# EAGLE design 8hpPhase (EAGLE 9.3.1)
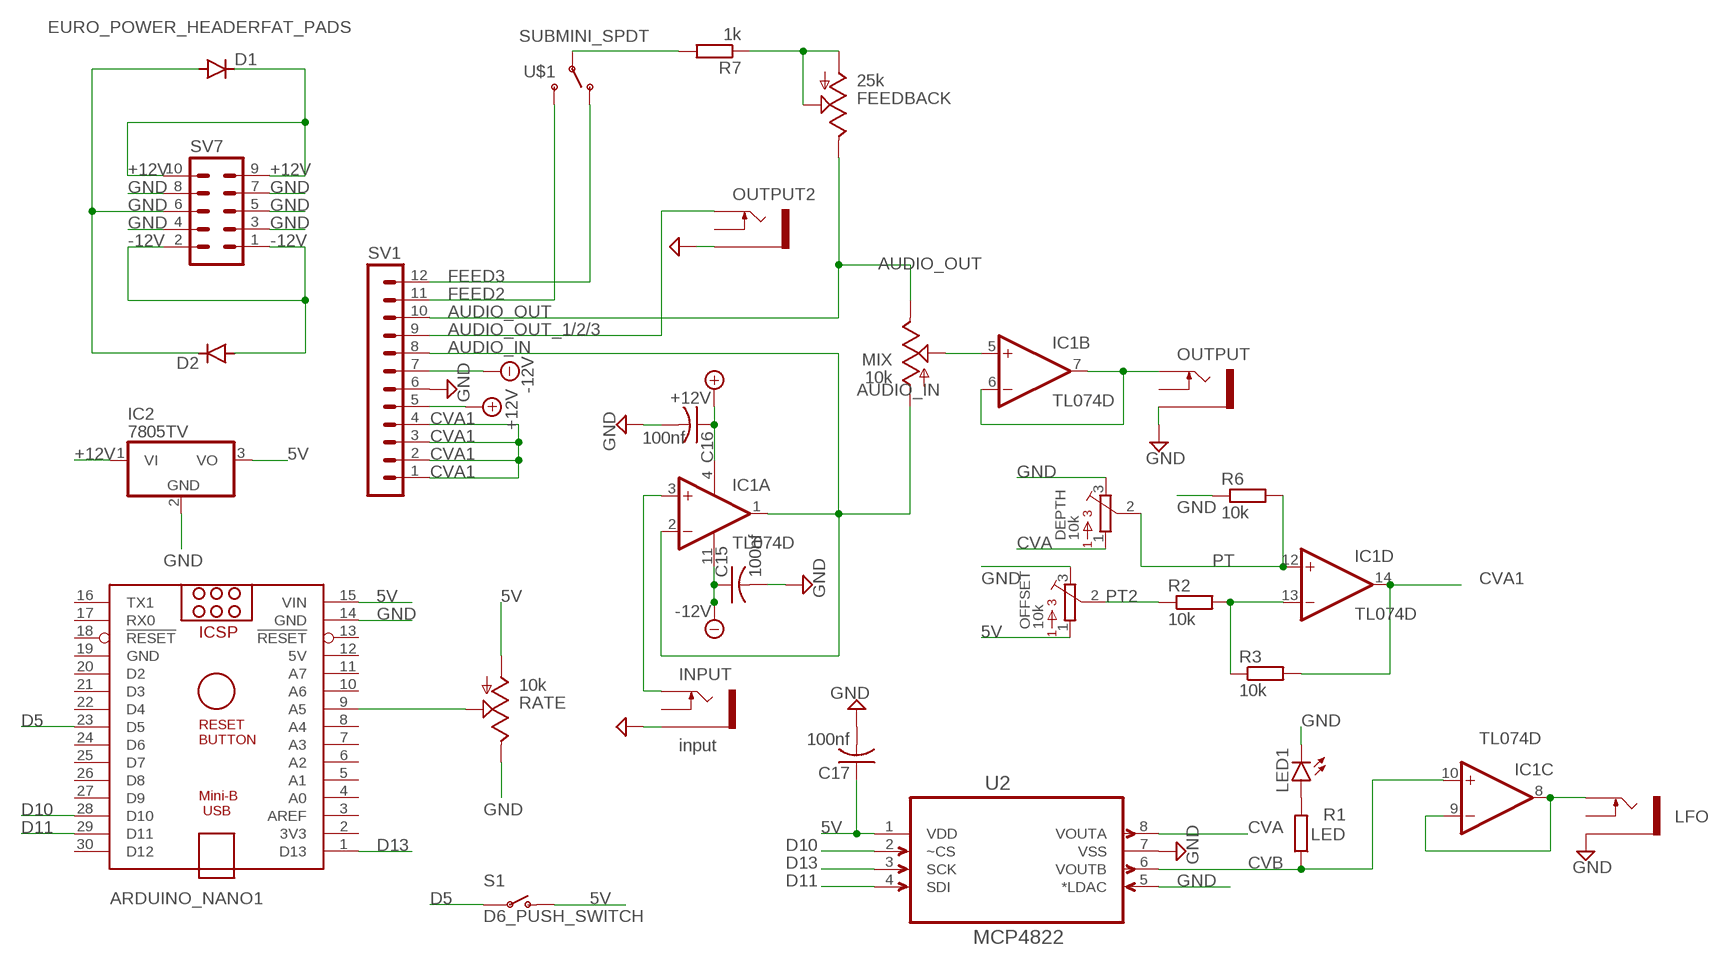
[diagram p0: schematic, sheet 1]

## Parts
ARDUINO_NANO1  ARDUINO_NANO  [ARDUINO_NANO]
C15  100nf  C-USC0805  [C0805]
C16  100nf  C-USC0805  [C0805]
C17  100nf  C-USC0805  [C0805]
D1  DIODE-SOD106A-R  [SOD106A-R]
D2  DIODE-SOD106A-R  [SOD106A-R]
DEPTH  10k  BOURNS_3362P_TRIMMERP  [BOURNS_3362P_TRIMMER]
FEEDBACK  25k  9MM_SNAP-IN_POT_  [9MM_SNAP-IN_POT]
IC1  TL074D  [SO14]
IC2  7805TV  [TO220V]
INPUT  input  THONKICONNNEW  [WQP-PJ301M-12_JACK]
LED1  LED3MM  [LED3MM]
LFO  output  THONKICONNNEW  [WQP-PJ301M-12_JACK]
MIX  10k  9MM_SNAP-IN_POT_  [9MM_SNAP-IN_POT]
OFFSET  10k  BOURNS_3362P_TRIMMERP  [BOURNS_3362P_TRIMMER]
OUTPUT  output  THONKICONNNEW  [WQP-PJ301M-12_JACK]
OUTPUT2  output  THONKICONNNEW  [WQP-PJ301M-12_JACK]
R1  LED  R-EU_M0805  [M0805]
R2  10k  R-EU_M0805  [M0805]
R3  10k  R-EU_M0805  [M0805]
R6  10k  R-EU_M0805  [M0805]
R7  1k  R-EU_M0805  [M0805]
RATE  10k  9MM_SNAP-IN_POT_  [9MM_SNAP-IN_POT]
S1  D6_PUSH_SWITCH  [D6_PUSH_SWITCH]
SV1  MA12-1  [MA12-1]
SV7  EURO_POWER_HEADERFAT_PADS  [EURO_PWR_HEADER_FAT]
U2  MCP4822  MCP4802-E/SN  [SOIC127P600X175-8N]
U$1  SUBMINI_SPDT  [SUBMINI_TOGGLE]

## Nets
5V: ARDUINO_NANO1.15(VIN) C17.1 IC2.3(VO) OFFSET.1 RATE.1(A) S1.P$1(O) S1.P$2(O) U2.1(VDD)
+12V: C16.1 D1.C IC1.4(P:V+) IC2.1(VI) SV1.5 SV7.9 SV7.10
-12V: C15.1 D2.A IC1.11(P:V-) SV1.7 SV7.1 SV7.2
AUDIO_IN: IC1.1(A:OUT) IC1.2(A:-IN) MIX.1(A) SV1.8
AUDIO_OUT: FEEDBACK.3(E) MIX.3(E) SV1.10
AUDIO_OUT_1/2/3: OUTPUT2.P$1_TIP(TIP) SV1.9
CVA: DEPTH.1 U2.8(VOUTA)
CVA1: IC1.14(D:OUT) R3.2 SV1.1 SV1.2 SV1.3 SV1.4
CVB: IC1.10(C:+IN) R1.1 U2.6(VOUTB)
D5: ARDUINO_NANO1.23(D5) S1.P$3(P) S1.P$4(P)
D10: ARDUINO_NANO1.28(D10) U2.2(~CS)
D11: ARDUINO_NANO1.29(D11) U2.4(SDI)
D13: ARDUINO_NANO1.1(D13) U2.3(SCK)
FEED2: SV1.11 U$1.3(S)
FEED3: SV1.12 U$1.1(O)
GND: ARDUINO_NANO1.14(GND) C15.2 C16.2 C17.2 D1.A D2.C DEPTH.3 IC2.2(GND) INPUT.P$3_SLEEVE(SLEEVE) LED1.K(C) LFO.P$3_SLEEVE(SLEEVE) OFFSET.3 OUTPUT2.P$3_SLEEVE(SLEEVE) OUTPUT.P$3_SLEEVE(SLEEVE) R6.1 RATE.3(E) SV1.6 SV7.3 SV7.4 SV7.5 SV7.6 SV7.7 SV7.8 U2.5(*LDAC) U2.7(VSS)
N$1: IC1.13(D:-IN) R2.2 R3.1
N$2: IC1.8(C:OUT) IC1.9(C:-IN) LFO.P$1_TIP(TIP)
N$3: LED1.A R1.2
N$4: ARDUINO_NANO1.9(A5) RATE.2(S)
N$5: IC1.5(B:+IN) MIX.2(S)
N$6: IC1.6(B:-IN) IC1.7(B:OUT) OUTPUT.P$1_TIP(TIP)
N$21: IC1.3(A:+IN) INPUT.P$1_TIP(TIP)
N$22: R7.2 U$1.COM(COMMON)
N$71: FEEDBACK.1(A) FEEDBACK.2(S) R7.1
PT: DEPTH.2 IC1.12(D:+IN) R6.2
PT2: OFFSET.2 R2.1
Unconnected: ARDUINO_NANO1.2(3V3) ARDUINO_NANO1.3(AREF) ARDUINO_NANO1.4(A0) ARDUINO_NANO1.5(A1) ARDUINO_NANO1.6(A2) ARDUINO_NANO1.7(A3) ARDUINO_NANO1.8(A4) ARDUINO_NANO1.10(A6) ARDUINO_NANO1.11(A7) ARDUINO_NANO1.13(!RESET) ARDUINO_NANO1.16(TX1) ARDUINO_NANO1.17(RX0) ARDUINO_NANO1.18(!RESET) ARDUINO_NANO1.20(D2) ARDUINO_NANO1.21(D3) ARDUINO_NANO1.22(D4) ARDUINO_NANO1.24(D6) ARDUINO_NANO1.25(D7) ARDUINO_NANO1.26(D8) ARDUINO_NANO1.27(D9) ARDUINO_NANO1.30(D12) INPUT.P$2_SWITCH(SWITCH) LFO.P$2_SWITCH(SWITCH) OUTPUT2.P$2_SWITCH(SWITCH) OUTPUT.P$2_SWITCH(SWITCH)

## Power pins joined to a net without a drawn wire
5V: ARDUINO_NANO1.12(5V)
GND: ARDUINO_NANO1.19(GND)

## Library data of the parts
ARDUINO_NANO1 = ArduinoNanoV30:ARDUINO_NANO: Arduino Nano V3.0 Overview: The Arduino Nano is a small, complete, and breadboard-friendly board based on the ATmega328 (Arduino Nano 3.x) or ATmega168 (Arduino Nano 2.x). It has more or less the same functionality of the Arduino Duemilanove, but in a different package. It lacks only a DC power jack, and works with a Mini-B USB cable instead of a standard one. The Nano was designed and is being produced by Gravitech. Specifications: Microcontroller Atmel ATmega168 or ATmega328 Operating Voltage (logic level) 5 V Input Voltage (recommended) 7-12 V Input Voltage (limits) 6-20 V Digital I/O Pins 14 (of which 6 provide PWM output) Analog Input Pins 8 DC Current per I/O Pin 40 mA Flash Memory 16 KB (ATmega168) or 32 KB (ATmega328) of which 2 KB used by bootloader SRAM 1 KB (ATmega168) or 2 KB (ATmega328) EEPROM 512 bytes (ATmega168) or 1 KB (ATmega328) Clock Speed 16 MHz Dimensions 0.73" x 1.70" Length 45 mm Width 18 mm Weigth 5 g Power: The Arduino Nano can be powered via the Mini-B USB connection, 6-20V unregulated external power supply (pin 30), or 5V regulated external power supply (pin 27). The power source is automatically selected to the highest voltage source. Memory: The ATmega168 has 16 KB of flash memory for storing code (of which 2 KB is used for the bootloader); the ATmega328 has 32 KB, (also with 2 KB used for the bootloader). The ATmega168 has 1 KB of SRAM and 512 bytes of EEPROM (which can be read and written with the EEPROM library); the ATmega328 has 2 KB of SRAM and 1 KB of EEPROM. Input and Output: Each of the 14 digital pins on the Nano can be used as an input or output, using pinMode(), digitalWrite(), and digitalRead() functions. They operate at 5 volts. Each pin can provide or receive a maximum of 40 mA and has an internal pull-up resistor (disconnected by default) of 20-50 kOhms. In addition, some pins have specialized functions. Visit Arduino - ArduinoBoardNano <https://www.arduino.cc/en/Main/ArduinoBoardNano>
C15-C17 = rcl:C-US: CAPACITOR, American symbol; SPICEPREFIX: C
D1 D2 = diode:DIODE-: DIODE
DEPTH OFFSET = MusicThingModular:BOURNS_3362P_TRIMMER: 3362 Series 1/4" Square Trimmer
FEEDBACK MIX RATE = MusicThingModular:9MM_SNAP-IN_POT: 9mm vertical snap-in pot, Alpha / Panasonic style
IC1 = linear:TL074: OP AMP
IC2 = linear:78*: Positive VOLTAGE REGULATOR Source: http://cache.national.com/ds/LM/LM78L05.pdf http://www.fairchildsemi.com/ds/LM/LM7805.pdf
INPUT LFO OUTPUT OUTPUT2 = MusicThingModular:THONKICONN: 3.5mm socket for Eurorack modular synths
LED1 = led:LED: LED OSRAM: - CHIPLED LG R971, LG N971, LY N971, LG Q971, LY Q971, LO R971, LY R971 LH N974, LH R974 LS Q976, LO Q976, LY Q976 LO Q996 - Hyper CHIPLED LW Q18S LB Q993, LB Q99A, LB R99A - SideLED LS A670, LO A670, LY A670, LG A670, LP A670 LB A673, LV A673, LT A673, LW A673 LH A674 LY A675 LS A676, LA A676, LO A676, LY A676, LW A676 LS A679, LY A679, LG A679 - Hyper Micro SIDELED® LS Y876, LA Y876, LO Y876, LY Y876 LT Y87S - SmartLED LW L88C, LW L88S LB L89C, LB L89S, LG L890 LS L89K, LO L89K, LY L89K LS L896, LA L896, LO L896, LY L896 - TOPLED LS T670, LO T670, LY T670, LG T670, LP T670 LSG T670, LSP T670, LSY T670, LOP T670, LYG T670 LG T671, LOG T671, LSG T671 LB T673, LV T673, LT T673, LW T673 LH T674 LS T676, LA T676, LO T676, LY T676, LB T676, LH T676, LSB T676, LW T676 LB T67C, LV T67C, LT T67C, LS T67K, LO T67K, LY T67K, LW E67C LS E67B, LA E67B, LO E67B, LY E67B, LB E67C, LV E67C, LT E67C LW T67C LS T679, LY T679, LG T679 LS T770, LO T770, LY T770, LG T770, LP T770 LB T773, LV T773, LT T773, LW T773 LH T774 LS E675, LA E675, LY E675, LS T675 LS T776, LA T776, LO T776, LY T776, LB T776 LHGB T686 LT T68C, LB T68C - Hyper Mini TOPLED® LB M676 - Mini TOPLED Santana® LG M470 LS M47K, LO M47K, LY M47K Source: http://www.osram.convergy.de LUXEON: - LUMILED® LXK2-PW12-R00, LXK2-PW12-S00, LXK2-PW14-U00, LXK2-PW14-V00 LXK2-PM12-R00, LXK2-PM12-S00, LXK2-PM14-U00 LXK2-PE12-Q00, LXK2-PE12-R00, LXK2-PE12-S00, LXK2-PE14-T00, LXK2-PE14-U00 LXK2-PB12-K00, LXK2-PB12-L00, LXK2-PB12-M00, LXK2-PB14-N00, LXK2-PB14-P00, LXK2-PB14-Q00 LXK2-PR12-L00, LXK2-PR12-M00, LXK2-PR14-Q00, LXK2-PR14-R00 LXK2-PD12-Q00, LXK2-PD12-R00, LXK2-PD12-S00 LXK2-PH12-R00, LXK2-PH12-S00 LXK2-PL12-P00, LXK2-PL12-Q00, LXK2-PL12-R00 Source: www.luxeon.com KINGBRIGHT: KA-3528ASYC Source: www.kingbright.com
R1-R3 R6 R7 = rcl:R-EU_: RESISTOR, European symbol; SPICEPREFIX: R
S1 = MusicThingModular:D6_PUSH_SWITCH: Push switch
SV1 = con-lstb:MA12-1: PIN HEADER; OC_FARNELL: unknown; OC_NEWARK: unknown
SV7 = MusicThingModular:EURO_POWER_HEADER: Power Header 10 pin power header for Eurorack Power Supplies Variants with fatter pads for easier soldering, and the LOCK variant which has 5mil offset pins to hold the component in place before soldering
U2 = MCP4802-E_SN:MCP4802-E/SN: DAC 8BIT DUAL SPI/VREF; DESCRIPTION: MCP4801 Series 2 Ch 8-bit SPI Interface Digital-to-Analog Converter - SOIC-8; DIGI-KEY_PART_NUMBER: MCP4802-E/SN-ND; DIGI-KEY_PURCHASE_URL: https://www.digikey.com/product-detail/en/microchip-technology/MCP4802-E-SN/MCP4802-E-SN-ND/2332808?utm_source=snapeda&utm_medium=aggregator&utm_campaign=symbol; MF: Microchip; MP: MCP4802-E/SN; PACKAGE: SOIC-8 Microchip
U$1 = MusicThingModular:SUBMINI_SPDT

## Net classes
0 default: width 0.635 mm, drill 0.254 mm, clearance 0.254 mm
1 thicker: width 1.905 mm, drill 0.254 mm, clearance 0.635 mm
2 biggi: width 3.81 mm, drill 0.635 mm, clearance 0.635 mm

## Board
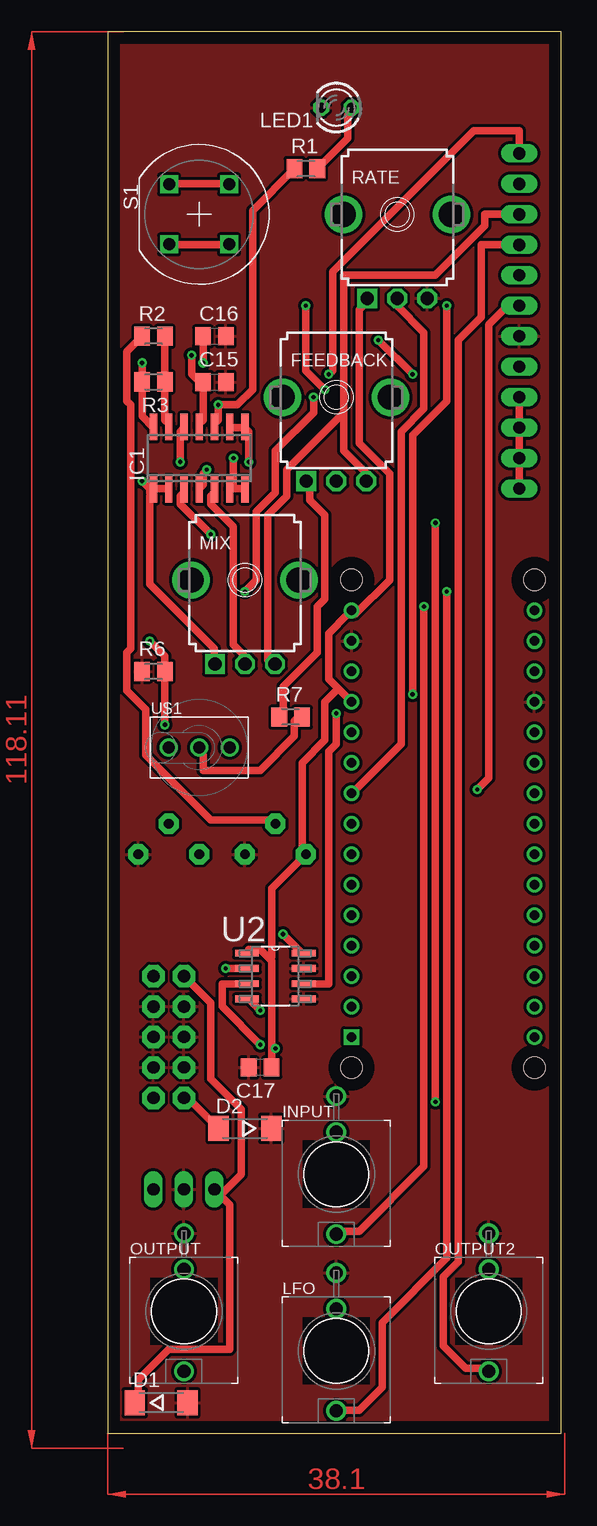
[diagram p1: board, top side]
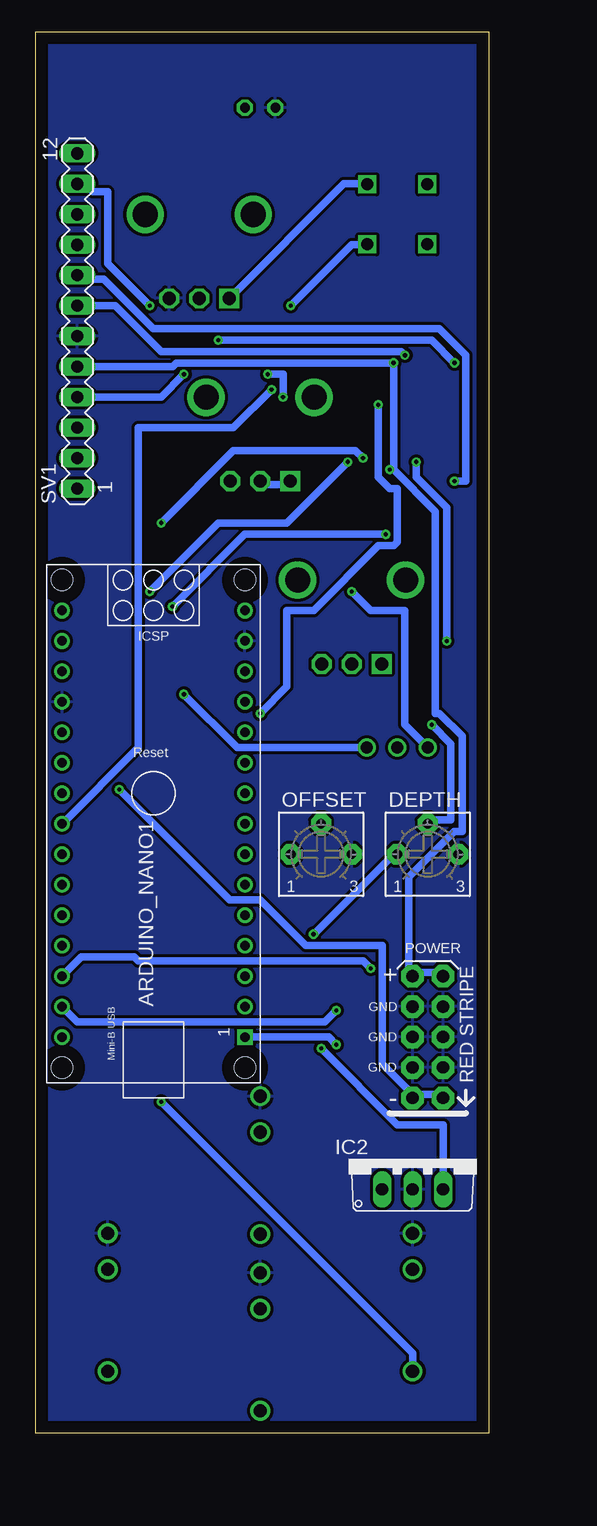
[diagram p2: board, bottom side, seen from below]

Size 37.77 x 116.83 mm. Coordinates in mm from the lower left corner, seen from the top.
Outline: 0,0 37.77,0 37.77,116.83 0,116.83 0,0
Copper layers (1*16): Top 0.035mm / dielectric 1.5mm / Bottom 0.035mm
Design rules "default": minimum track width 6mil, minimum drill 0.35mm, track to track 6mil, track to pad 6mil, pad to pad 6mil, via to via 6mil, smd to smd 6mil, copper to edge 40mil, drill to drill 6mil, minimum pad ring 10mil, minimum via ring 8mil, stop-mask expansion 4mil, vias tented up to drill 0mil, thermal gap 10mil

### Footprints (pad centres in the part's own frame; a part is rotated, then mirrored left to right if it is on the bottom)
ARDUINO_NANO = drill 0.8 square: 1 -20.32,-7.62 | drill 0.8: 2 -17.78,-7.62; 3 -15.24,-7.62; 4 -12.7,-7.62; 5 -10.16,-7.62; 6 -7.62,-7.62; 7 -5.08,-7.62; 8 -2.54,-7.62; 9 0,-7.62; 10 2.54,-7.62; 11 5.08,-7.62; 12 7.62,-7.62; 13 10.16,-7.62; 14 12.7,-7.62; 15 15.24,-7.62; 16 15.24,7.62; 17 12.7,7.62; 18 10.16,7.62; 19 7.62,7.62; 20 5.08,7.62; 21 2.54,7.62; 22 0,7.62; 23 -2.54,7.62; 24 -5.08,7.62; 25 -7.62,7.62; 26 -10.16,7.62; 27 -12.7,7.62; 28 -15.24,7.62; 29 -17.78,7.62; 30 -20.32,7.62 | hole 1.778: -22.86,-7.62; -22.86,7.62; 17.78,7.62; 17.78,-7.62
C0805 = smd 1.3 x 1.5: 1 -0.95,0; 2 0.95,0
SOD106A-R = smd 1.7 x 2.1: A 2.2,0; C -2.2,0
BOURNS_3362P_TRIMMER = drill 0.813 pad 1.676 octagon: 1 -2.54,0; 2 0,2.54; 3 2.54,0
9MM_SNAP-IN_POT = drill 1.1 square: 1 -2.5,-7 | drill 1.1 octagon: 2 0,-7; 3 2.5,-7 | drill 2.1 pad 2.794: CHASSIS1 -4.5,0; CHASSIS2 4.5,0
SO14 = smd 0.6 x 2.2: 1 -3.81,-2.6; 2 -2.54,-2.6; 3 -1.27,-2.6; 4 0,-2.6; 5 1.27,-2.6; 6 2.54,-2.6; 7 3.81,-2.6; 8 3.81,2.6; 9 2.54,2.6; 10 1.27,2.6; 11 0,2.6; 12 -1.27,2.6; 13 -2.54,2.6; 14 -3.81,2.6
TO220V = drill 1.016 long: 1 -2.54,-2.54; 2 0,-2.54; 3 2.54,-2.54
WQP-PJ301M-12_JACK = drill 1.1: P$1_TIP 0,5; P$2_SWITCH 0,-3.5; P$3_SLEEVE 0,-6.5
LED3MM = drill 0.813 octagon: A -1.27,0; K 1.27,0
M0805 = smd 1.3 x 1.6: 1 -0.95,0; 2 0.95,0
D6_PUSH_SWITCH = drill 1 square: P$1 -2.5,2.5; P$2 2.5,2.5; P$3 2.5,-2.5; P$4 -2.5,-2.5
MA12-1 = drill 1.016 long: 1 -13.97,0; 2 -11.43,0; 3 -8.89,0; 4 -6.35,0; 5 -3.81,0; 6 -1.27,0; 7 1.27,0; 8 3.81,0; 9 6.35,0; 10 8.89,0; 11 11.43,0; 12 13.97,0
EURO_PWR_HEADER_FAT = drill 1.016 pad 1.88 octagon: 1 -5.08,-1.27; 2 -5.08,1.27; 3 -2.54,-1.27; 4 -2.54,1.27; 5 0,-1.27; 6 0,1.27; 7 2.54,-1.27; 8 2.54,1.27; 9 5.08,-1.27; 10 5.08,1.27
SOIC127P600X175-8N = smd 1.981 x 0.559: 1 -2.362,1.905; 2 -2.362,0.635; 3 -2.362,-0.635; 4 -2.362,-1.905; 5 2.362,-1.905; 6 2.362,-0.635; 7 2.362,0.635; 8 2.362,1.905
SUBMINI_TOGGLE = drill 1 pad 1.422: 1 -2.54,0; 3 2.54,0; COM 0,0

### Placement (x,y rotation side)
ARDUINO_NANO1  27.94,53.34 90 bottom
C15  8.89,87.63 0 top
C16  8.89,91.44 0 top
C17  12.7,30.48 180 top
D1  4.45,2.54 0 top
D2  11.43,25.4 180 top
DEPTH  5.08,48.26 0 bottom
FEEDBACK  19.05,86.36 0 top
IC1  7.62,81.28 0 top
IC2  6.35,22.86 0 bottom
INPUT  19.05,21.59 180 top
LED1  19.05,110.49 180 top
LFO  19.05,6.86 180 top
MIX  11.43,71.12 0 top
OFFSET  13.97,48.26 0 bottom
OUTPUT  6.35,10.16 180 top
OUTPUT2  31.75,10.16 180 top
R1  16.51,105.41 0 top
R2  3.81,91.44 0 top
R3  3.81,87.63 180 top
R6  3.81,63.5 0 top
R7  15.24,59.69 0 top
RATE  24.13,101.6 0 top
S1  7.62,101.6 0 top
SV1  34.29,92.71 90 bottom
SV7  5.08,33.02 90 bottom
U2  13.97,38.1 0 top
U$1  7.62,57.15 0 top

### Tracks (layer width: path | path; a pad name or v marks a point on that pad's centre or on a via)
5V  (via drill 0.35)
  Top 0.635: S1.P$1 5.4,104.14 9.84,104.14 S1.P$2 | 19.21,62.07 18.41,62.87 18.41,66.67 20,68.26 20.32,68.26 | 19.21,62.07 ARDUINO_NANO1.12 | 13.65,32.07 13.65,39.37 13.49,39.53 | 13.65,32.07 C17.1 | 13.49,39.53 12.7,40.32 11.75,40.32 11.75,40.01 U2.1 | 13.65,32.07 v13.97,32.07 | 13.49,39.53 13.65,39.69 13.65,45.4 OFFSET.1 16.19,48.26 16.19,55.88 18.1,57.78 18.1,60.96 19.21,62.07 | 20.32,68.26 20.64,68.26 23.5,71.12 23.5,80.01 20.95,82.55 20.95,93.66 21.59,94.3 RATE.1 | 20.32,68.26 ARDUINO_NANO1.15
  Bottom 0.635: RATE.1 21.59,94.61 12.06,104.14 10.16,104.14 S1.P$2 | IC2.3 3.81,25.72 7.62,25.72 v13.97,32.07
+12V  (via drill 0.35)
  Top 0.635: v7.94,89.22 C16.1 | v8.26,80.33 7.94,80.01 7.94,79.06 7.62,78.74 IC1.4 | D1.C 2.54,2.54 2.54,4.45 5.08,6.99 10.16,6.99 10.16,19.05 IC2.1 9.53,20 11.11,21.59 11.11,26.99 8.57,29.53 8.57,35.88 SV7.10
  Bottom 0.635: 7.94,80.33 v7.94,89.22 26.04,89.22 26.35,88.9 SV1.5 | SV7.9 4.13,38.42 6.03,38.42 SV7.10 6.35,38.42 6.67,38.42 6.67,46.35 2.86,50.16 2.22,50.16 2.22,58.1 4.13,60.01 4.45,60.01 4.45,76.83 7.94,80.33 | 7.94,80.33 v8.26,80.33
-12V  (via drill 0.35)
  Top 0.635: SV7.2 6.67,27.94 9.21,25.4 D2.A | 7.94,87.31 7.94,84.45 7.62,84.14 IC1.11 | 7.94,87.31 C15.1 7.94,87.31 | v6.99,89.85 6.99,88.27 7.94,87.31 | v30.8,53.66 31.75,54.61 31.75,92.39 33.34,93.98 SV1.7
  Bottom 0.635: SV7.1 4.13,28.26 6.03,28.26 SV7.2 6.35,28.26 8.89,30.8 8.89,40.64 15.24,40.64 19.05,44.45 21.59,44.45 v30.8,53.66 | SV1.7 31.11,93.98 27.3,90.17 7.3,90.17 v6.99,89.85
AUDIO_IN  (via drill 0.35)
  Top 0.635: IC1.2 5.08,78.74 3.81,78.74 IC1.1 3.81,78.42 3.65,78.26 | 3.65,78.26 3.49,78.11 3.49,70.8 8.89,65.41 8.89,64.14 MIX.1 | v2.86,79.38 3.49,78.74 3.49,78.42 3.65,78.26
  Bottom 0.635: SV1.8 33.97,96.2 32.07,96.2 27.94,92.08 4.13,92.08 1.91,89.85 1.91,79.38 v2.86,79.38
AUDIO_OUT
  Top 0.635: SV1.10 31.43,101.6 31.43,100.65 27.3,96.52 19.68,96.52 19.68,85.09 | 19.68,85.09 19.68,81.92 21.59,80.01 21.59,79.38 FEEDBACK.3 | 19.68,85.09 14.92,80.33 14.92,78.11 13.34,76.52 13.34,64.45 13.65,64.14 MIX.3
AUDIO_OUT_1/2/3
  Top 0.635: SV1.9 31.11,99.06 31.11,93.03 29.21,91.12 29.21,14.29 27.94,13.02 27.94,7.3 29.84,5.4 31.75,5.4 OUTPUT2.P$1_TIP
CVA  (via drill 0.35)
  Top 0.635: v14.61,41.59 16.19,40.01 U2.8
  Bottom 0.635: v14.61,41.59 7.94,48.26 DEPTH.1
CVA1  (via drill 0.35)
  Top 0.635: SV1.1 SV1.2 SV1.3 SV1.4 | R3.2 2.86,84.77 3.81,83.82 IC1.14 | v2.86,89.22 R3.2 | v25.4,88.27 v22.54,91.12 | R3.2
  Bottom 0.635: v2.86,89.22 4.76,91.12 v22.54,91.12 | v25.4,88.27 27.3,86.36 SV1.4
CVB  (via drill 0.35)
  Top 0.635: R1.1 12.06,101.92 12.06,87 10.79,85.72 v9.21,85.72 9.21,84.45 8.89,84.14 IC1.10 | U2.6 18.41,37.47 18.41,56.83 19.05,57.47 v19.05,60.01
  Bottom 0.635: v19.05,60.01 16.83,62.23 16.83,68.58 14.61,68.58 9.21,73.98 7.94,73.98 7.62,74.3 7.62,78.74 8.26,78.74 9.21,79.69 v9.21,85.72
D5  (via drill 0.35)
  Top 0.635: v18.1,87 16.51,88.58 v16.51,93.98 | S1.P$4 5.4,99.06 9.84,99.06 S1.P$3
  Bottom 0.635: ARDUINO_NANO1.23 29.21,57.15 29.21,83.82 21.27,83.82 v18.1,87 | v16.51,93.98 11.43,99.06 10.16,99.06 S1.P$3
D10  (via drill 0.35)
  Top 0.635: v9.84,38.73 U2.2
  Bottom 0.635: v9.84,38.73 10.48,39.37 29.21,39.37 29.53,39.69 33.97,39.69 35.24,38.42 35.24,38.1 ARDUINO_NANO1.28
D11  (via drill 0.35)
  Top 0.635: v12.7,35.24 11.75,36.2 U2.4
  Bottom 0.635: v12.7,35.24 13.65,34.29 34.29,34.29 35.24,35.24 35.24,35.56 ARDUINO_NANO1.29
D13  (via drill 0.35)
  Top 0.635: U2.3 9.53,37.47 9.53,35.56 v12.7,32.38
  Bottom 0.635: v12.7,32.38 13.34,33.02 ARDUINO_NANO1.1
FEED2  (via drill 0.35)
  Top 0.635: v25.4,61.59 25.4,83.19 28.26,86.04 v28.26,93.98
  Bottom 0.635: U$1.3 20.95,57.15 v25.4,61.59 | v28.26,93.98 31.75,97.47 31.75,103.5 33.02,103.5 33.66,104.14 SV1.11
FEED3  (via drill 0.35)
  Top 0.635: v11.43,70.17 12.38,71.12 12.38,76.83 13.97,78.42 13.97,81.92 17.14,85.09 v17.14,86.36 | v18.41,88.27 18.73,88.58 18.73,96.84 30.48,108.58 34.29,108.58 SV1.12
  Bottom 0.635: U$1.1 6.99,59.05 6.99,68.58 9.84,68.58 v11.43,70.17 | v17.14,86.36 17.14,88.27 v18.41,88.27
GND
  pour Top: 0,116.84 36.83,116.84 38.1,115.57 38.1,1.27 36.83,0 0,0
  pour Bottom: 0,116.84 36.83,116.84 38.1,115.57 38.1,1.27 36.83,0 0,0
N$1
  Top 0.635: R3.1 R2.2 | R3.1 4.76,84.45 5.08,84.14 IC1.13 | R3.1
N$2  (via drill 0.35)
  Top 0.635: 11.43,83.82 10.16,83.82 IC1.9 | 11.43,83.82 11.75,83.5 v11.75,80.96 | v28.26,70.17 28.26,14.61 22.86,9.21 22.86,3.81 20.95,1.91 19.05,1.91 LFO.P$1_TIP | 11.43,83.82 IC1.8
  Bottom 0.635: v11.75,80.96 16.83,75.88 22.54,75.88 v28.26,70.17
N$3
  Top 0.635: LED1.A 20.32,110.17 20,109.86 20,107.95 R1.2
N$4
  Top 0.635: ARDUINO_NANO1.9 24.45,57.47 24.45,83.5 26.35,85.41 26.35,91.76 24.13,93.98 RATE.2
N$5
  Top 0.635: MIX.2 11.43,64.77 10.48,65.72 10.48,75.56 8.57,77.47 8.57,78.11 8.89,78.42 IC1.5
N$6  (via drill 0.35)
  Top 0.635: 10.48,78.74 11.43,78.74 IC1.7 | 10.48,78.74 10.16,78.74 IC1.6 | v10.48,81.28 10.48,78.74 | v27.3,27.62 v27.3,75.88
  Bottom 0.635: v10.48,81.28 11.11,81.92 21.27,81.92 v27.3,75.88 | v27.3,27.62 6.35,6.67 OUTPUT.P$1_TIP
N$21  (via drill 0.35)
  Top 0.635: v8.57,74.93 6.03,77.47 6.03,78.11 6.35,78.42 IC1.3 | v26.35,68.9 26.35,22.23 20.95,16.83 19.05,16.83 INPUT.P$1_TIP
  Bottom 0.635: v8.57,74.93 20.32,74.93 v26.35,68.9
N$22
  Top 0.635: U$1.COM 7.62,56.83 7.94,56.52 7.94,55.24 12.7,55.24 15.56,58.1 15.56,59.37 15.88,59.69 R7.2
N$71
  Top 0.635: R7.1 14.61,59.69 14.61,62.23 17.46,65.09 17.46,68.9 18.1,69.53 18.1,76.52 16.83,77.79 16.83,79.06 FEEDBACK.1
  Bottom 0.635: FEEDBACK.2 19.05,79.06 16.83,79.06 FEEDBACK.1
PT  (via drill 0.35)
  Top 0.635: v4.76,59.05 R6.2 | v6.03,80.96 6.03,83.5 6.35,83.82 IC1.12 | v3.49,66.04 4.76,64.77 R6.2 | R6.2
  Bottom 0.635: v4.76,59.05 3.17,57.47 3.17,51.12 4.76,51.12 DEPTH.2 | v6.03,80.96 6.03,79.69 3.49,77.15 v3.49,66.04
PT2
  Top 0.635: OFFSET.2 13.97,51.12 8.57,51.12 3.17,56.52 3.17,60.33 1.59,61.91 1.59,65.09 1.91,65.41 1.91,85.72 1.59,86.04 1.59,90.17 R2.1
(copper drawn outside any net)
  shapes: Top area x2